# EAGLE design Adafruit_AS7341 (EAGLE 9.5.2)
COMPANY: ADAFRUIT INDUSTRIES; DRAWN: KTOWN; REV: A
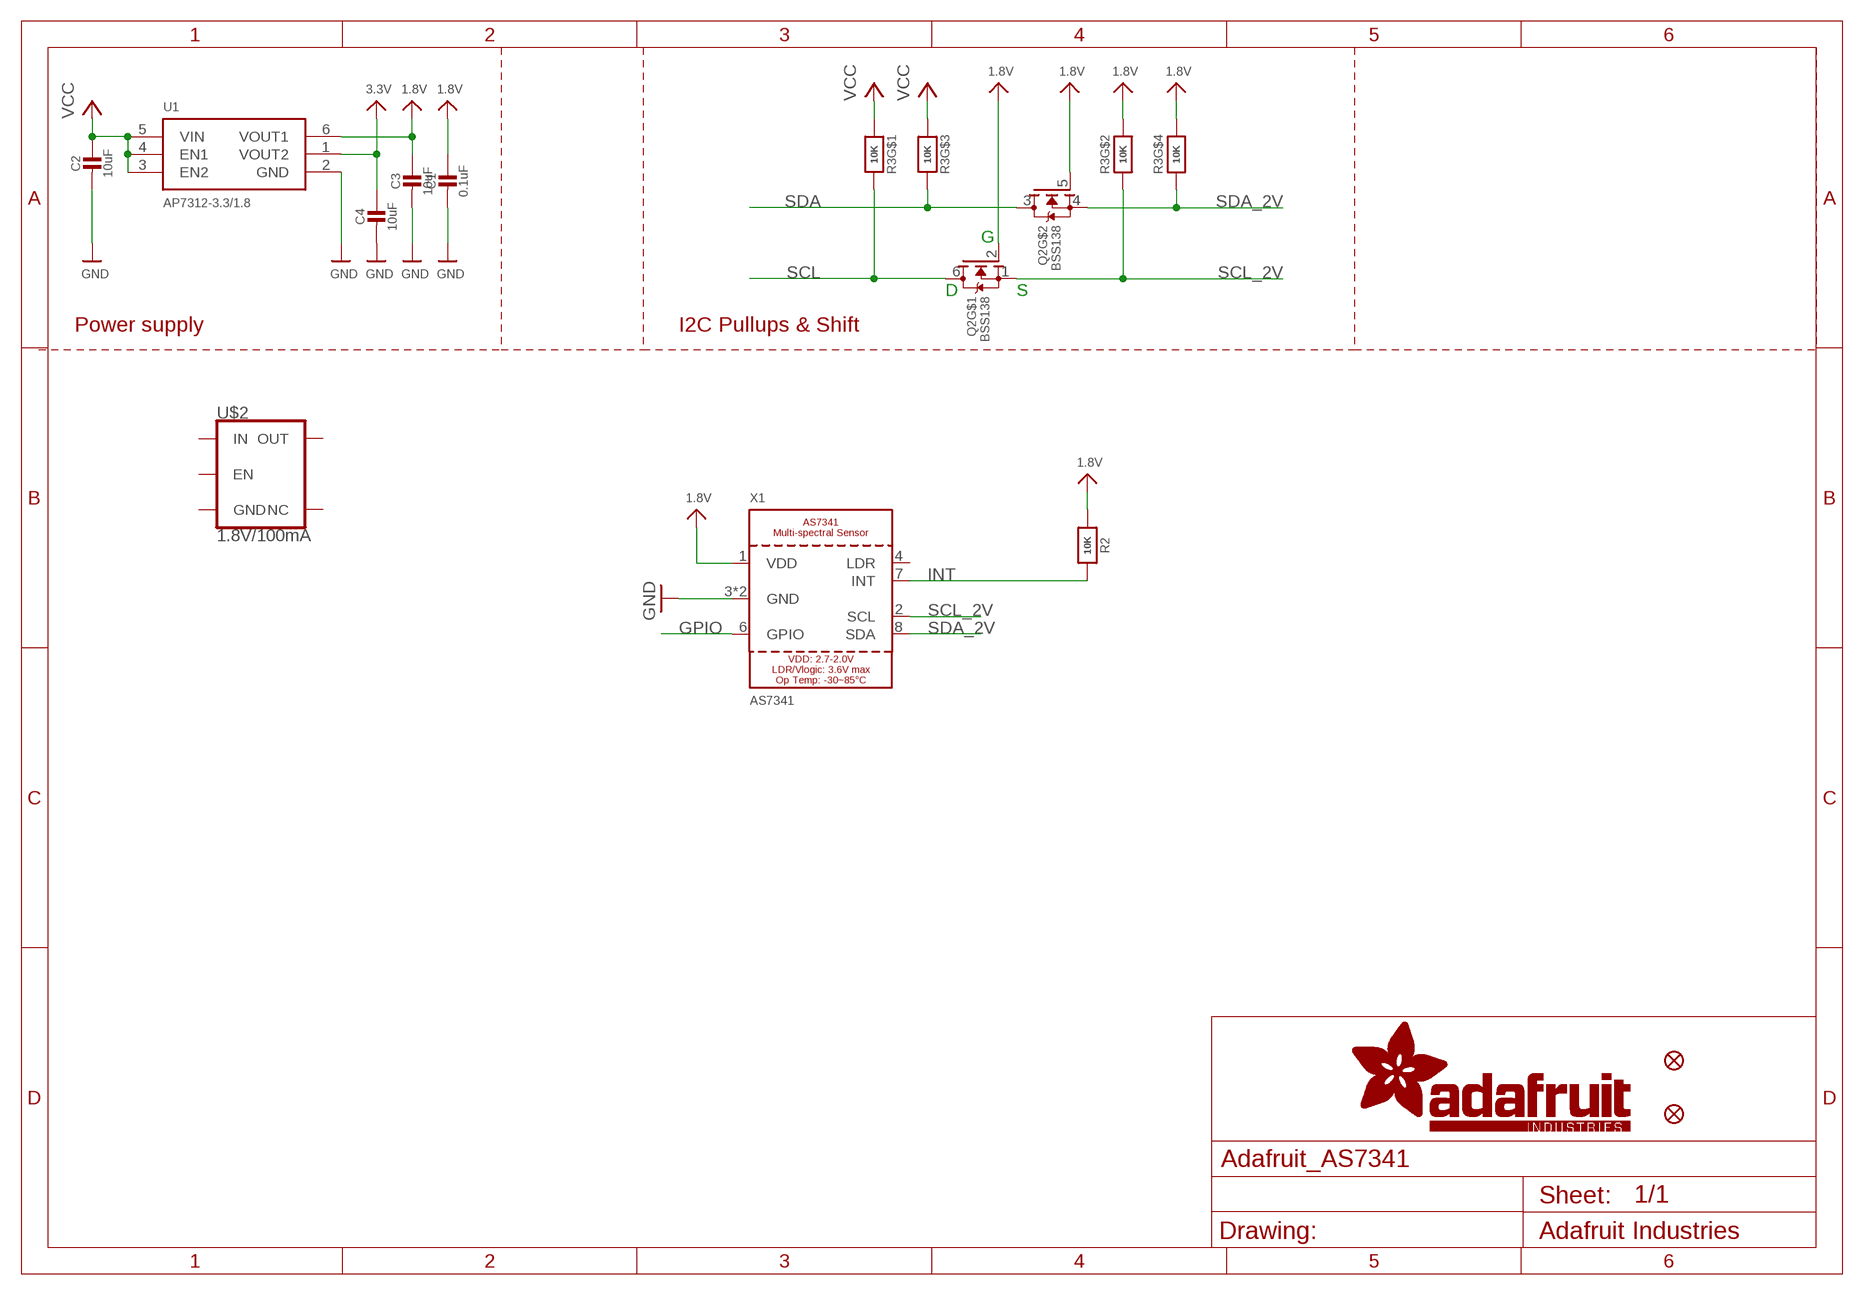
[diagram p0: schematic, sheet 1]

## Parts
C1  0.1uF  CAP_CERAMIC0603_NO  [0603-NO]
C2  10uF  CAP_CERAMIC0805-NOOUTLINE  [0805-NO]
C3  10uF  CAP_CERAMIC0805-NOOUTLINE  [0805-NO]
C4  10uF  CAP_CERAMIC0805-NOOUTLINE  [0805-NO]
FID3  FIDUCIAL_1MM  [FIDUCIAL_1MM]
FID4  FIDUCIAL_1MM  [FIDUCIAL_1MM]
Q2  BSS138  MOSFET-N_DUAL  [SOT363]
R2  10K  RESISTOR_0603_NOOUT  [0603-NO]
R3  10K  RESISTOR_4PACK  [RESPACK_4X0603]
U1  AP7312-3.3/1.8  VREG_SOT23-6_DUALAP7312  [SOT23-6]
U$2  1.8V/100mA  V_REG_SP6214-1.8V  [SC70]
X1  AS7341  [AS7341]

## Nets
1.8V [lowpower]: C1.1 C3.1 Q2.2(G) Q2.5(G) R2.1 R3.2 R3.4 U1.6(VOUT1) X1.1(VDD)
3.3V: C4.1 U1.1(VOUT2)
GND [highpower]: C1.2 C2.2 C3.2 C4.2 U1.2(GND) X1.3(GND) X1.5(GND)
GPIO: X1.6(GPIO)
INT: R2.2 X1.7(INT)
SCL: Q2.6(D) R3.8
SCL_2V: Q2.1(S) R3.7 X1.2(SCL)
SDA: Q2.3(D) R3.6
SDA_2V: Q2.4(S) R3.5 X1.8(SDA)
VCC [highpower]: C2.1 R3.1 R3.3 U1.3(EN2) U1.4(EN1) U1.5(VIN)
Unconnected: U$2.1(IN) U$2.2(GND) U$2.3(EN) U$2.4(NC) U$2.5(OUT) X1.4(LDR)

## Notes on the sheet
- G
- D | S
- Power supply | I2C Pullups & Shift

## Library data of the parts
C1-C4 = microbuilder:CAP_CERAMIC: Ceramic Capacitors For new designs, use the packages preceded by an '_' character since they are more reliable: The following footprints should be used on most boards: _0402 - Standard footprint for regular board layouts _0603 - Standard footprint for regular board layouts _0805 - Standard footprint for regular board layouts _1206 - Standard footprint for regular board layouts For extremely tight-pitch boards where space is at a premium, the following 'micro-pitch' footprints can be used (smaller pads, no silkscreen outline, etc.): _0402MP - Micro-pitch footprint for very dense/compact boards _0603MP - Micro-pitch footprint for very dense/compact boards _0805MP - Micro-pitch footprint for very dense/compact boards _1206MP - Micro-pitch footprint for very dense/compact boards
FID3 FID4 = microbuilder:FIDUCIAL: Fiducial Alignment Points Various fiducial points for machine vision alignment.; BOM: EXCLUDE
Q2 = microbuilder:MOSFET-N_DUAL: Dual N-Channel MOSFET SOT363 (2.0x1.25mm) 2N7002PS - 60V, 320mA [Digikey: 568-5984-1-ND]
R2 = microbuilder:RESISTOR: Resistors For new designs, use the packages preceded by an '_' character since they are more reliable: The following footprints should be used on most boards: _0402 - Standard footprint for regular board layouts _0603 - Standard footprint for regular board layouts _0805 - Standard footprint for regular board layouts _1206 - Standard footprint for regular board layouts For extremely tight-pitch boards where space is at a premium, the following 'micro-pitch' footprints can be used (smaller pads, no silkscreen outline, etc.): _0402MP - Micro-pitch footprint for very dense/compact boards _0603MP - Micro-pitch footprint for very dense/compact boards _0805MP - Micro-pitch footprint for very dense/compact boards _1206MP - Micro-pitch footprint for very dense/compact boards
R3 = microbuilder:RESISTOR_4PACK: Resistor Packs (4 resistors) 4 x 0603 10K 1/16W - Digikey: YC164J-10KCT-ND
U1 = adafruit_power:VREG_SOT23-6_DUAL: Dual Output SOT23-6 Linear Regulators Diodes Inc. AP7312 - Dual 150mA LDO Linear Regulator 0.2V dropout, 150mA output, 2-6V Input AP7312-1833W6-7 - 1.8V/3.3V SOT23-6 (Digikey: AP7312-1833W6-7DICT-ND) MIC5320 - Dual 150mA ULDO Linear Regulator Ultra-low 35mV dropout at 150mA, 2.3-5.5V Input 3.3V/1.8V SOT23-6 (Digikey: 576-1658-1-ND) 3.3V/1.5V SOT23-6 (Digikey: 576-3483-1-ND)
U$2 = SparkFun-IC-Power:V_REG_SP6214: Voltage Regulator - SP6214 SP6214 Series SC-70-5 Micropower SC-70 100 mA CMOS LDO Regulator Datasheet <https://www.exar.com/content/document.ashx?id=654> SparkFun Products: MP3 Trigger <https://www.sparkfun.com/products/13720> SparkFun Particle Sensor Breakout <https://www.sparkfun.com/products/14045>; PROD_ID: VREG-08428
X1 = adafruit_sensor:AS7341

## Net classes
1 highpower: width 0.305 mm, drill 0.483 mm
2 lowpower: width 0.254 mm, drill 0.483 mm

## Board
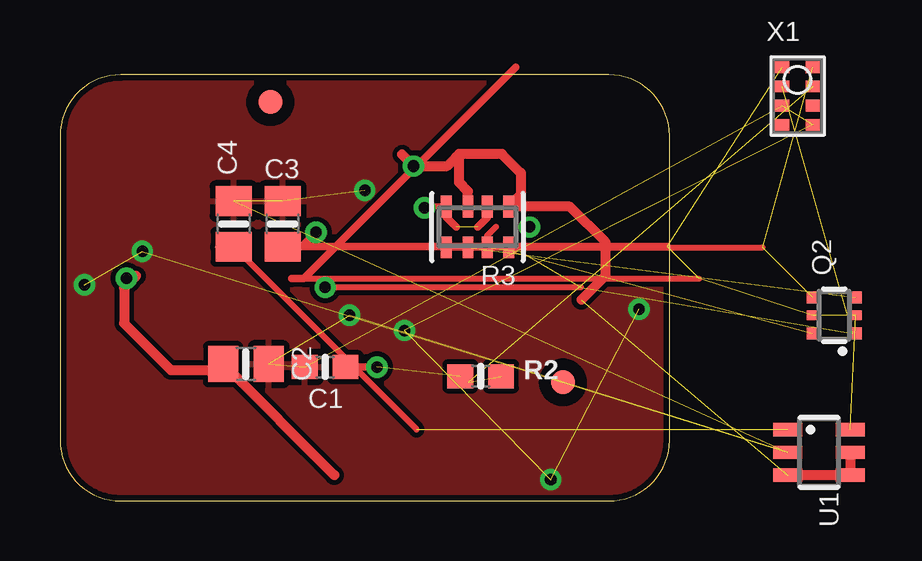
[diagram p1: board, top side]
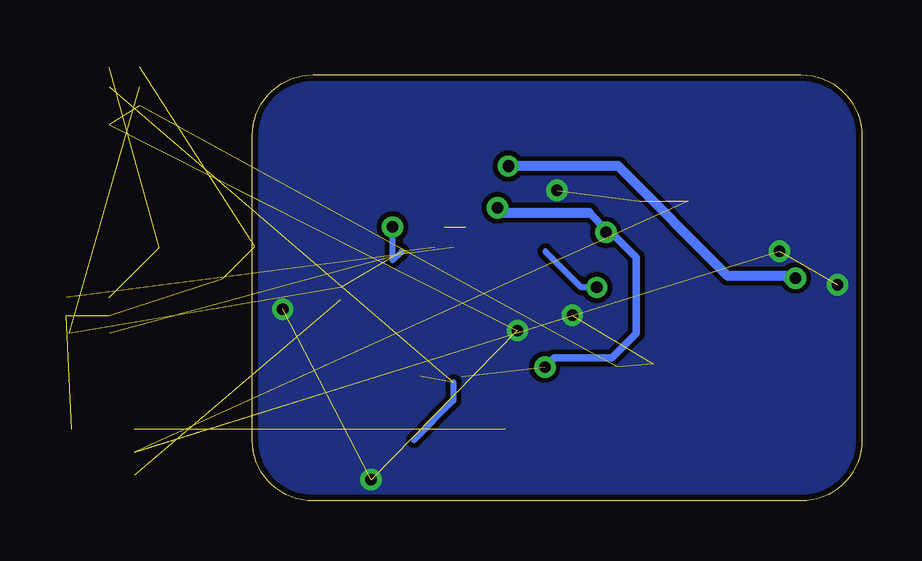
[diagram p2: board, bottom side, seen from below]

Size 25.4 x 17.78 mm. Coordinates in mm from the lower left corner, seen from the top.
Outline: 0,15.24 0,2.54 arc90 2.54,0 22.86,0 arc90 25.4,2.54 25.4,15.24 arc90 22.86,17.78 2.54,17.78 arc90 0,15.24
Copper layers (1*16): Top 0.035mm / dielectric 1.5mm / Bottom 0.035mm
Design rules "adafruit *": minimum track width 8mil, minimum drill 15.5mil, track to track 8mil, track to pad 8mil, pad to pad 8mil, via to via 8mil, smd to smd 8mil, copper to edge 10mil, drill to drill 8mil, minimum pad ring 10mil, minimum via ring 8mil, stop-mask expansion 2mil, vias tented up to drill 20mil, thermal gap 10mil

### Footprints (pad centres in the part's own frame; a part is rotated, then mirrored left to right if it is on the bottom)
0603-NO = smd 1.075 x 1: 1 -0.85,0; 2 0.85,0
0805-NO = smd 1.24 x 1.5: 1 -0.95,0; 2 0.95,0
FIDUCIAL_1MM = smd 1 x 1: 1 0,0
SOT363 = smd 0.5 x 0.5: 1 -0.75,-0.9; 3 0.75,-0.9; 4 0.75,0.9; 6 -0.75,0.9 | smd 0.4 x 0.5: 2 0,-0.9; 5 0,0.9
RESPACK_4X0603 = smd 0.45 x 0.9: 1 -1.3,-0.85; 2 -0.4,-0.85; 3 0.4,-0.85; 4 1.3,-0.85; 5 1.3,0.85; 6 0.4,0.85; 7 -0.4,0.85; 8 -1.3,0.85
SOT23-6 = smd 0.55 x 1.2: 1 -0.95,-1.3; 2 0,-1.3; 3 0.95,-1.3; 4 0.95,1.3; 5 0,1.3; 6 -0.95,1.3
SC70 = smd 0.4 x 0.75: 1 -0.65,-0.825; 2 0,-0.825; 3 0.65,-0.825; 4 0.65,0.825; 5 -0.65,0.825
AS7341 = smd 0.575 x 0.488: 1 -0.635,1.2; 2 -0.635,0.4; 3 -0.635,-0.4; 4 -0.635,-1.2; 5 0.635,-1.2; 6 0.635,-0.4; 7 0.635,0.4; 8 0.635,1.2

### Placement (x,y rotation side)
C1  11.05,5.59 180 top
C2  7.75,5.71 0 top
C3  9.27,11.56 90 top
C4  7.24,11.56 90 top
FID3  20.95,4.95 0 top
FID4  8.76,16.64 0 top
Q2  32.26,7.75 90 top  (outside the outline)
R2  17.53,5.21 0 top
R3  17.4,11.43 180 top
U1  31.62,2.03 270 top  (outside the outline)
U$2  -6.1,-10.16 0 top  (outside the outline)
X1  30.73,16.89 0 top  (outside the outline)

### Tracks (layer width: path | path; a pad name or v marks a point on that pad's centre or on a via)
1.8V  (via drill 0.48)  (7 unrouted)
  Top 0.254: R3.4 15.23,12.28 v15.18,12.23 | 9.65,9.27 26.63,9.27
  Top 0.305: 25.3,10.61 C3.1 10.07,10.61 v10.67,11.21 | R3.2 17.8,11.83 17.4,11.43 | 16.51,11.43 16.1,11.84 R3.4 | C1.1 v13.21,5.59 | 18.98,18.09 10.16,9.27 9.65,9.27
  Bottom 0.305: v13.21,5.59 12.83,5.97 10.41,5.97 9.4,6.99 9.4,10.16 10.44,11.21 v10.67,11.21 10.67,11.33 11.36,12.03
  Bottom 0.406: 11.36,12.03 14.98,12.03 v15.18,12.23
3.3V  (1 unrouted)
  Top 0.254: 6.58,10.61 C4.1 14.86,2.98
GND  (via drill 0.48)  (13 unrouted)
  other vias: 12.7,12.95 3.43,10.41 12.06,7.75 24.13,8 1.02,9.02 14.35,7.11 20.45,0.89
  pour Top: 0,17.78 25.4,17.78 25.4,0 0,0
  pour Bottom: 0,17.78 25.4,17.78 25.4,0 0,0
INT  (2 unrouted)
  Bottom 0.254: 17.02,4.95 17.02,4.19 18.67,2.54
SCL  (1 unrouted)
  Top 0.254: 18.89,10.39 R3.8
SCL_2V  (via drill 0.48)  (4 unrouted)
  Top 0.254: Q2.1 33.03,7 | R3.7 17.8,11.07 18.16,11.43 | v19.56,11.43 | 21.72,8.91 v11.05,8.91
  Bottom 0.254: v19.56,11.43 19.56,10.03 19.18,10.41 | v11.05,8.91 11.68,8.91 13.19,10.41
SDA  (1 unrouted)
SDA_2V  (2 unrouted)
  Top 0.254: R3.5 29.27,10.58
VCC  (via drill 0.48)  (1 unrouted)
  Top 0.406: U1.5 U1.4 U1.3 | C2.1 11.43,1.08 | C2.1 6.54,5.46 4.62,5.46 2.67,7.41 2.67,8.89 3.17,9.39 2.86,9.39 v2.77,9.3 | C2.1 6.35,5.27 | 16.62,14.35 16.51,14.35 16.13,13.97 v14.73,13.97 14.25,14.45 | 16.62,14.35 16.62,14.48 18.41,14.48 19.21,13.69 19.21,12.79 R3.1 21.25,12.28 22.73,10.79 22.73,9.4 21.73,8.39 | 16.62,14.35 16.62,13.3 17,12.91 R3.3
  Bottom 0.406: v2.77,9.3 3.11,9.3 3.2,9.39 5.58,9.39 10.16,13.97 v14.73,13.97